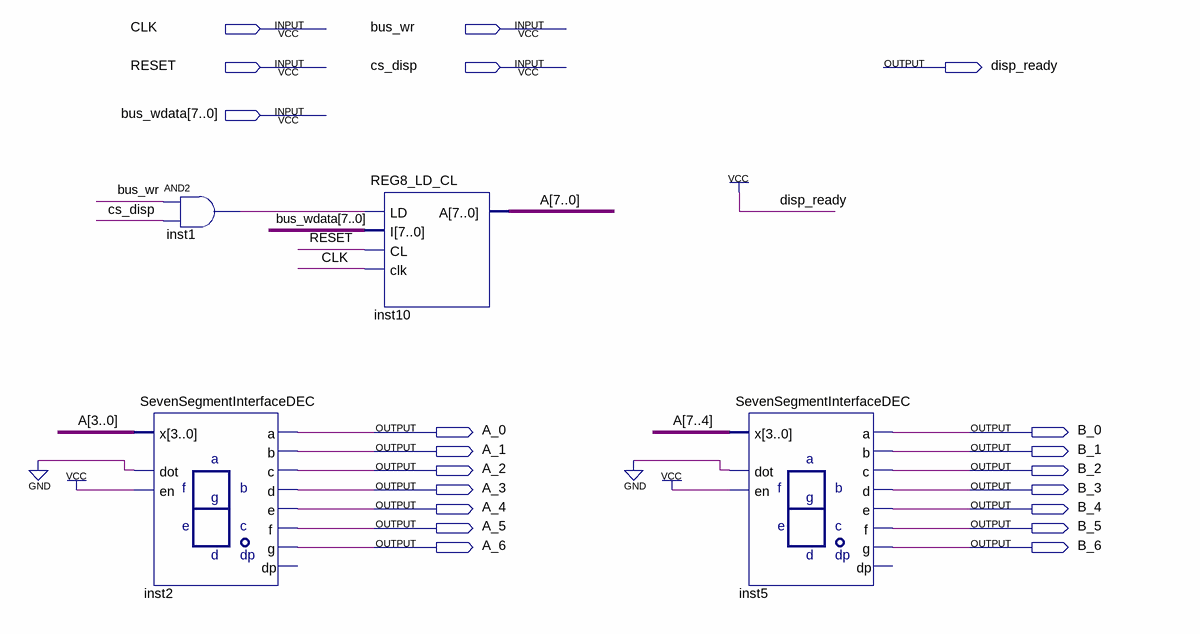
[diagram p0: schematic sheet]
// Quartus schematic SevenSegBusInterface.bdf as structural Verilog: 4 symbols, 20 pins
module SevenSegBusInterface (
  input  CLK,
  input  bus_wr,
  input  RESET,
  input  cs_disp,
  input  [7:0] bus_wdata,
  output disp_ready,
  output A_0,
  output B_0,
  output A_1,
  output B_1,
  output A_2,
  output B_2,
  output A_3,
  output B_3,
  output A_4,
  output B_4,
  output A_5,
  output B_5,
  output A_6,
  output B_6
);

  wire inst1_out;
  wire [7:0] A;

  and inst1 (inst1_out, bus_wr, cs_disp);
  SevenSegmentInterfaceDEC inst2 (
    .dot(1'b0), .en(1'b1), .x(A[3:0]), .a(A_0), .b(A_1), .c(A_2), .d(A_3), .e(A_4), .f(A_5), .g(A_6));  // open: dp
  REG8_LD_CL inst10 (.LD(inst1_out), .I(bus_wdata), .CL(RESET), .clk(CLK), .A(A));
  SevenSegmentInterfaceDEC inst5 (
    .dot(1'b0), .en(1'b1), .x(A[7:4]), .a(B_0), .b(B_1), .c(B_2), .d(B_3), .e(B_4), .f(B_5), .g(B_6));  // open: dp

  assign disp_ready = 1'b1;
endmodule
